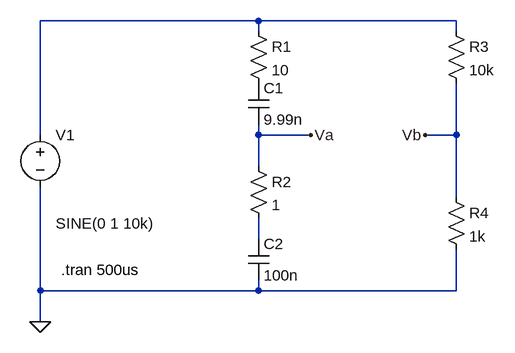
[diagram p0: schematic wien_bruecke.asc]
wien_bruecke.asc, the LTspice schematic file:
Version 4
SHEET 1 880 680
WIRE 112 80 -224 80
WIRE 416 80 112 80
WIRE 112 96 112 80
WIRE 416 96 416 80
WIRE -224 256 -224 80
WIRE 112 256 112 240
WIRE 192 256 112 256
WIRE 416 256 416 176
WIRE 416 256 368 256
WIRE 112 304 112 256
WIRE 416 352 416 256
WIRE 112 416 112 384
WIRE -224 496 -224 336
WIRE 112 496 112 480
WIRE 112 496 -224 496
WIRE 416 496 416 432
WIRE 416 496 112 496
WIRE -224 544 -224 496
FLAG -224 544 0
FLAG 192 256 Va
FLAG 368 256 Vb
SYMBOL cap 96 176 R0
SYMATTR InstName C1
SYMATTR Value 9.99n
SYMBOL cap 96 416 R0
SYMATTR InstName C2
SYMATTR Value 100n
SYMBOL res 96 80 R0
SYMATTR InstName R1
SYMATTR Value 10
SYMBOL res 96 288 R0
SYMATTR InstName R2
SYMATTR Value 1
SYMBOL res 400 80 R0
SYMATTR InstName R3
SYMATTR Value 10k
SYMBOL res 400 336 R0
SYMATTR InstName R4
SYMATTR Value 1k
SYMBOL voltage -224 240 R0
WINDOW 3 24 152 Left 2
WINDOW 39 0 0 Left 2
SYMATTR InstName V1
SYMATTR Value SINE(0 1 10k)
SYMATTR Value2 AC 1
TEXT -192 464 Left 2 !.tran 500us

The netlist it stands for:
* wien_bruecke.asc
C1 P001 Va 9.99n
C2 N002 0 100n
R1 N001 P001 10
R2 Va N002 1
R3 N001 Vb 10k
R4 Vb 0 1k
V1 N001 0 SINE(0 1 10k) AC 1
.tran 500us
.backanno
.end